# Altium schematic sheet P2_CCD_CAM_BOARD_POWER.SchDoc (part 1 of 3)
size A3
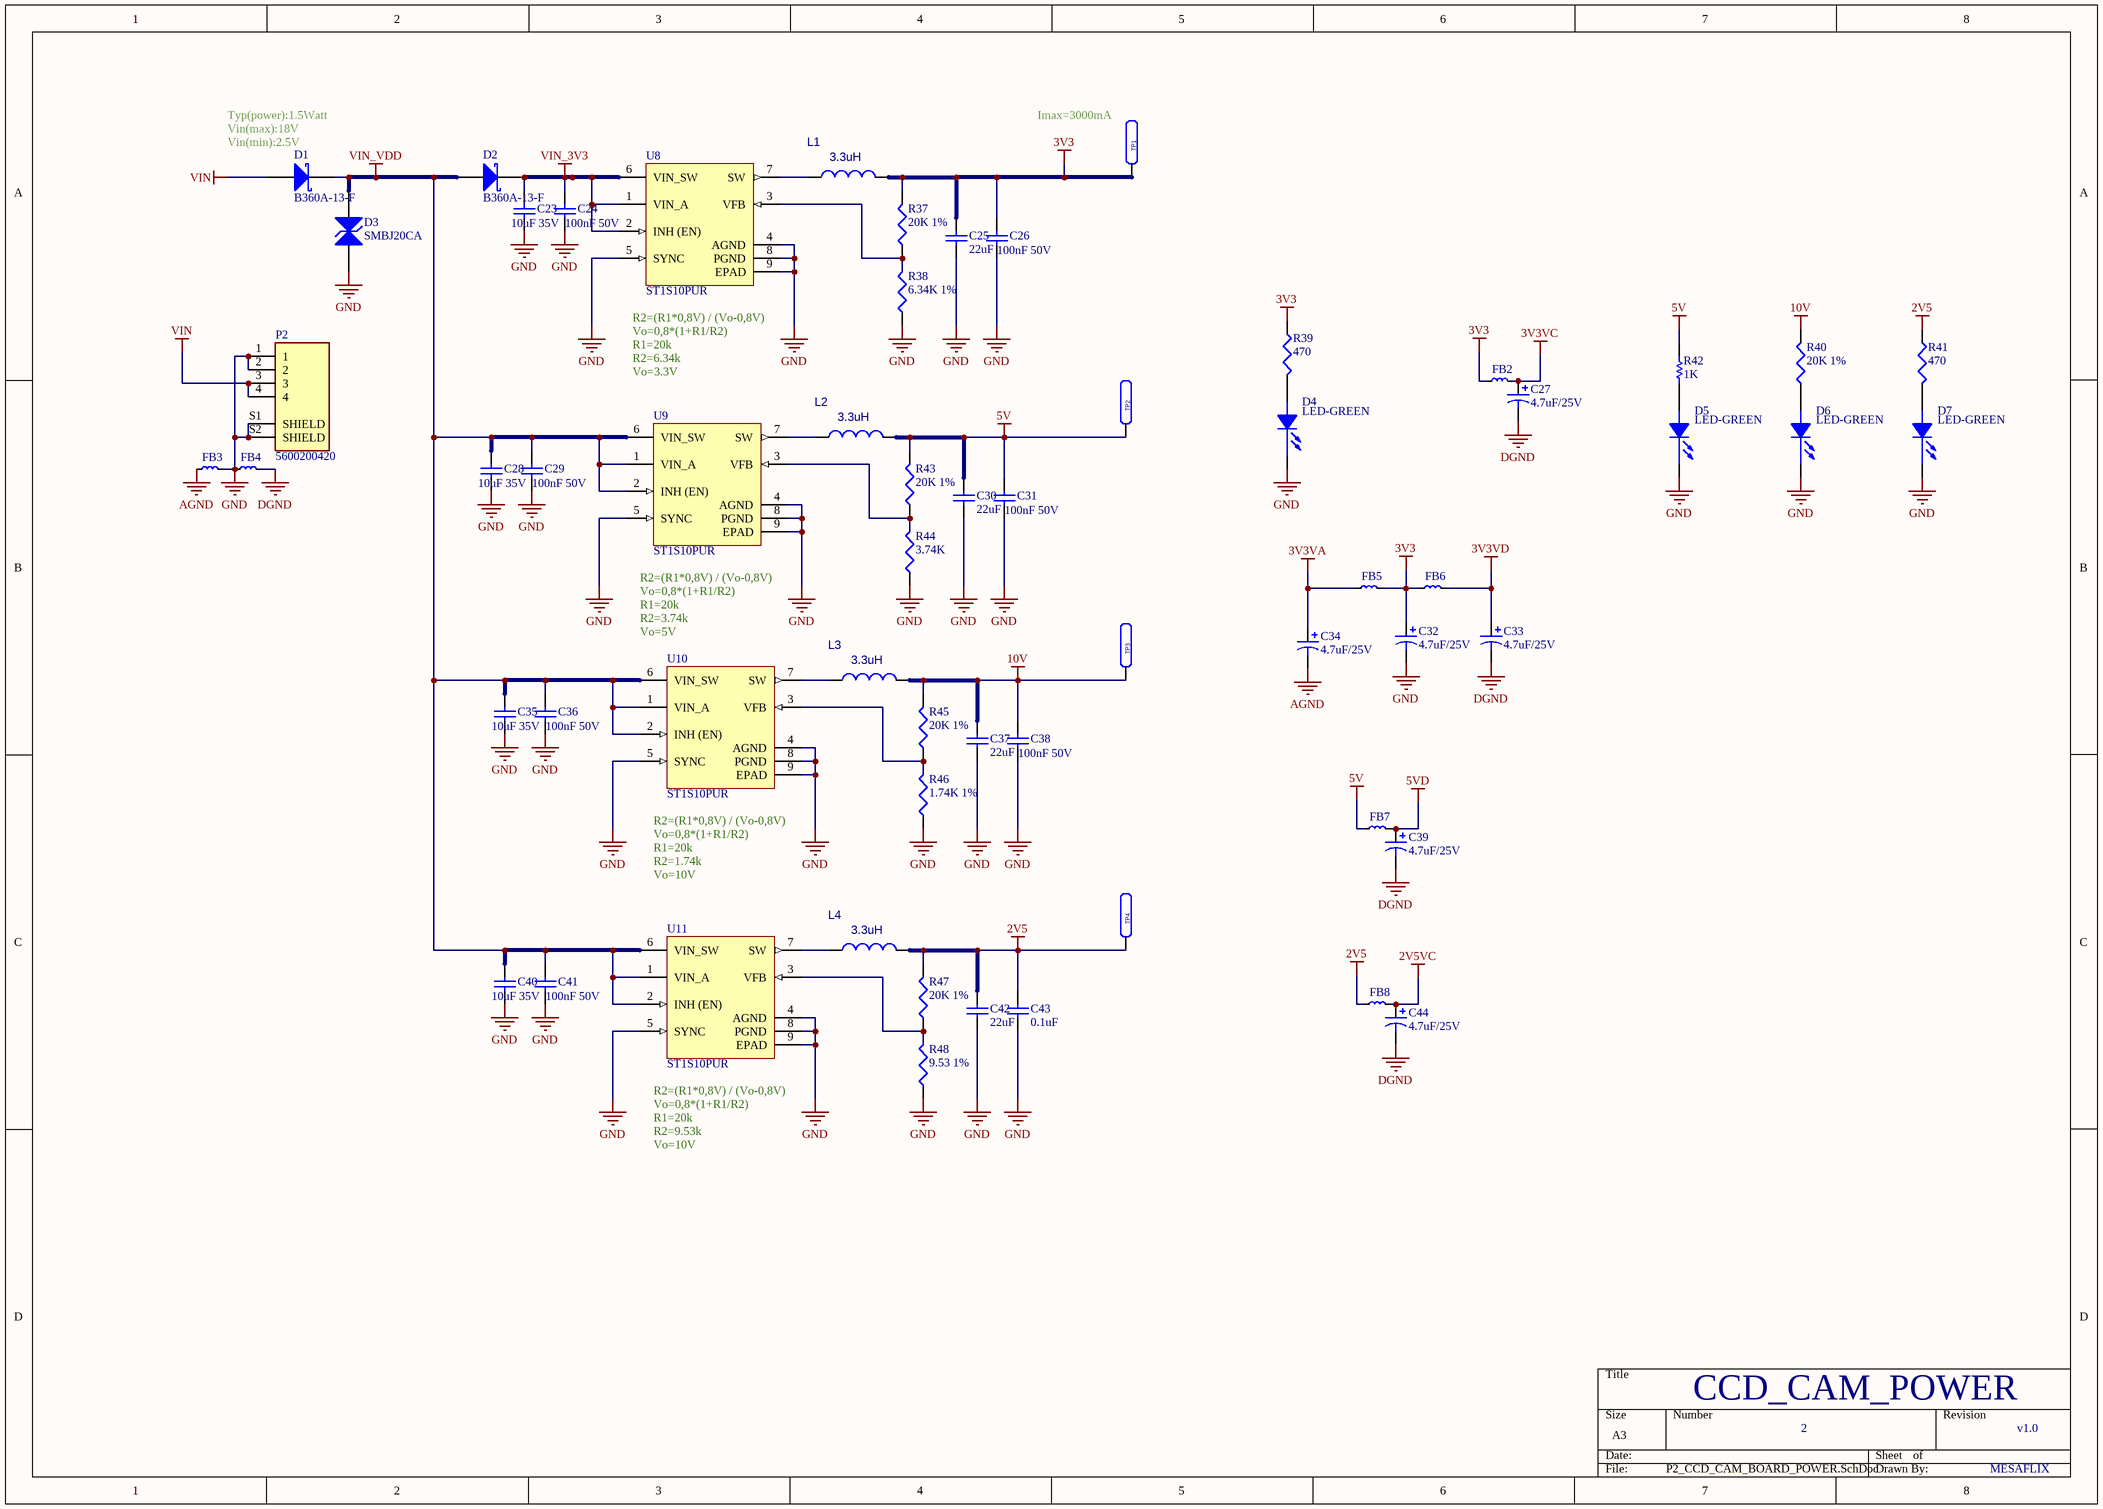
[diagram p0: P2_CCD_CAM_BOARD_POWER.SchDoc]

## Parts
C23  10uF 35V  [C 0603(1608)x0.8]
C24  100nF 50V  [CAP0603]
C25  22uF  [C 0603(1608)x0.8]
C26  100nF 50V  [CAP0603]
C27  value 4.7uF/25V  [0805 (2012)]  (hidden comment: GRM219R61E475KA73D)
C28  10uF 35V  [C 0603(1608)x0.8]
C29  100nF 50V  [CAP0603]
C30  22uF  [C 0603(1608)x0.8]
C31  100nF 50V  [CAP0603]
C32  value 4.7uF/25V  [0805 (2012)]  (hidden comment: GRM219R61E475KA73D)
C33  value 4.7uF/25V  [0805 (2012)]  (hidden comment: GRM219R61E475KA73D)
C34  value 4.7uF/25V  [0805 (2012)]  (hidden comment: GRM219R61E475KA73D)
C35  10uF 35V  [C 0603(1608)x0.8]
C36  100nF 50V  [CAP0603]
C37  22uF  [C 0603(1608)x0.8]
C38  100nF 50V  [CAP0603]
C39  value 4.7uF/25V  [0805 (2012)]  (hidden comment: GRM219R61E475KA73D)
C40  10uF 35V  [C 0603(1608)x0.8]
C41  100nF 50V  [CAP0603]
C42  22uF  [C 0603(1608)x0.8]
C43  0.1uF  [C 0402(1005)x0.5]
C44  value 4.7uF/25V  [0805 (2012)]  (hidden comment: GRM219R61E475KA73D)
D1  B360A-13-F  [DIOD-B360A_V]
D2  B360A-13-F  [DIOD-B360A_V]
D3  SMBJ20CA  [FAIR-DO-214AA-A-2_V]
D4  LED-GREEN  [LED_0603]
D5  LED-GREEN  [LED_0603]
D6  LED-GREEN  [LED_0603]
D7  LED-GREEN  [LED_0603]
FB2  NFZ2MSD600SN10L  [FB0806]  (value not drawn)
FB3  NFZ2MSD600SN10L  [FB0806]  (value not drawn)
FB4  NFZ2MSD600SN10L  [FB0806]  (value not drawn)
FB5  NFZ2MSD600SN10L  [FB0806]  (value not drawn)
FB6  NFZ2MSD600SN10L  [FB0806]  (value not drawn)
FB7  NFZ2MSD600SN10L  [FB0806]  (value not drawn)
FB8  NFZ2MSD600SN10L  [FB0806]  (value not drawn)
L1  3.3uH  [IFSC1515AHER]
L2  3.3uH  [IFSC1515AHER]
L3  3.3uH  [IFSC1515AHER]
L4  3.3uH  [IFSC1515AHER]
P2  5600200420  [MOLEX_5600200420_3D]
R37  20K 1%  [R 0402(1005)]
R38  6.34K 1%  [R 0402(1005)]
R39  470  [R 0402(1005)]
R40  20K 1%  [R 0402(1005)]
R41  470  [R 0402(1005)]
R42  value 1K  [CAP_RES_1608_0603]  (hidden comment: RES_1K_0603)
R43  20K 1%  [R 0402(1005)]
R44  3.74K  [R 0402(1005)]
R45  20K 1%  [R 0402(1005)]
R46  1.74K 1%  [R 0402(1005)]
R47  20K 1%  [R 0402(1005)]
R48  9.53 1%  [R 0402(1005)]
TP1  3V7  [LTPT35C49P]  (value not drawn)
TP2  3V7  [LTPT35C49P]  (value not drawn)
TP3  3V7  [LTPT35C49P]  (value not drawn)
TP4  3V7  [LTPT35C49P]  (value not drawn)
U8  ST1S10PUR  [DFN(4x4)_N]
U9  ST1S10PUR  [DFN(4x4)_N]
U10  ST1S10PUR  [DFN(4x4)_N]
U11  ST1S10PUR  [DFN(4x4)_N]

## Nets
2V5: C42.1 C43.2 FB8.1 L4.2 R41.1 R47.2 TP4.1
2V5VC: C44.1 FB8.2
3V3: C25.1 C26.2 C32.1 FB2.1 FB5.2 FB6.1 L1.2 R37.2 R39.1 TP1.1
3V3VA: C34.1 FB5.1
3V3VC: C27.1 FB2.2
3V3VD: C33.1 FB6.2
5V: C30.1 C31.2 FB7.1 L2.2 R42.1 R43.2 TP2.1
5VD: C39.1 FB7.2
10V: C37.1 C38.2 L3.2 R40.2 R45.2 TP3.1
AGND: C34.2 FB3.1
DGND: C27.2 C33.2 C39.2 C44.2 FB4.2
GND: C23.2 C24.1 C25.2 C26.1 C28.2 C29.1 C30.2 C31.1 C32.2 C35.2 C36.1 C37.2 C38.1 C40.2 C41.1 C42.2 C43.1 D3.1(A) D4.2(CATHODE) D5.2(CATHODE) D6.2(CATHODE) D7.2(CATHODE) FB3.2 FB4.1 P2.1 P2.2 P2.S1(SHIELD) P2.S2(SHIELD) R38.1 R44.1 R46.1 R48.1 U8.4(AGND) U8.5(SYNC) U8.8(PGND) U8.9(EPAD) U9.4(AGND) U9.5(SYNC) U9.8(PGND) U9.9(EPAD) U10.4(AGND) U10.5(SYNC) U10.8(PGND) U10.9(EPAD) U11.4(AGND) U11.5(SYNC) U11.8(PGND) U11.9(EPAD)
VIN: D1.1(A) P2.3 P2.4
VIN_3V3: C23.1 C24.2 D2.2(K) U8.1(VIN_A) U8.2(INH_(EN)) U8.6(VIN_SW)
VIN_VDD: C28.1 C29.2 C35.1 C36.2 C40.1 C41.2 D1.2(K) D2.1(A) D3.2(A) U9.1(VIN_A) U9.2(INH_(EN)) U9.6(VIN_SW) U10.1(VIN_A) U10.2(INH_(EN)) U10.6(VIN_SW) U11.1(VIN_A) U11.2(INH_(EN)) U11.6(VIN_SW)
NetD4_1: D4.1(ANODE) R39.2
NetD5_1: D5.1(ANODE) R42.2
NetD6_1: D6.1(ANODE) R40.1
NetD7_1: D7.1(ANODE) R41.2
NetL1_1: L1.1 U8.7(SW)
NetL2_1: L2.1 U9.7(SW)
NetL3_1: L3.1 U10.7(SW)
NetL4_1: L4.1 U11.7(SW)
NetR37_1: R37.1 R38.2 U8.3(VFB)
NetR43_1: R43.1 R44.2 U9.3(VFB)
NetR45_1: R45.1 R46.2 U10.3(VFB)
NetR47_1: R47.1 R48.2 U11.3(VFB)

## Notes on the sheet
- (near D1) Vin(max):18V
- Typ(power):1.5Watt
- (near D1) Vin(min):2.5V
- (near TP1) Imax=3000mA
- Vo=0,8*(1+R1/R2)
- R1=20k
- R2=6.34k
- Vo=3.3V
- (near U8) R2=(R1*0,8V) / (Vo-0,8V)
- (near U9) R2=(R1*0,8V) / (Vo-0,8V)
- R2=3.74k
- (near U10) Vo=5V
- (near U10) R2=(R1*0,8V) / (Vo-0,8V)
- R2=1.74k
- Vo=10V
- (near U11) R2=(R1*0,8V) / (Vo-0,8V)
- R2=9.53k
- CCD_CAM_POWER
- 2
- v1.0
- MESAFLIX